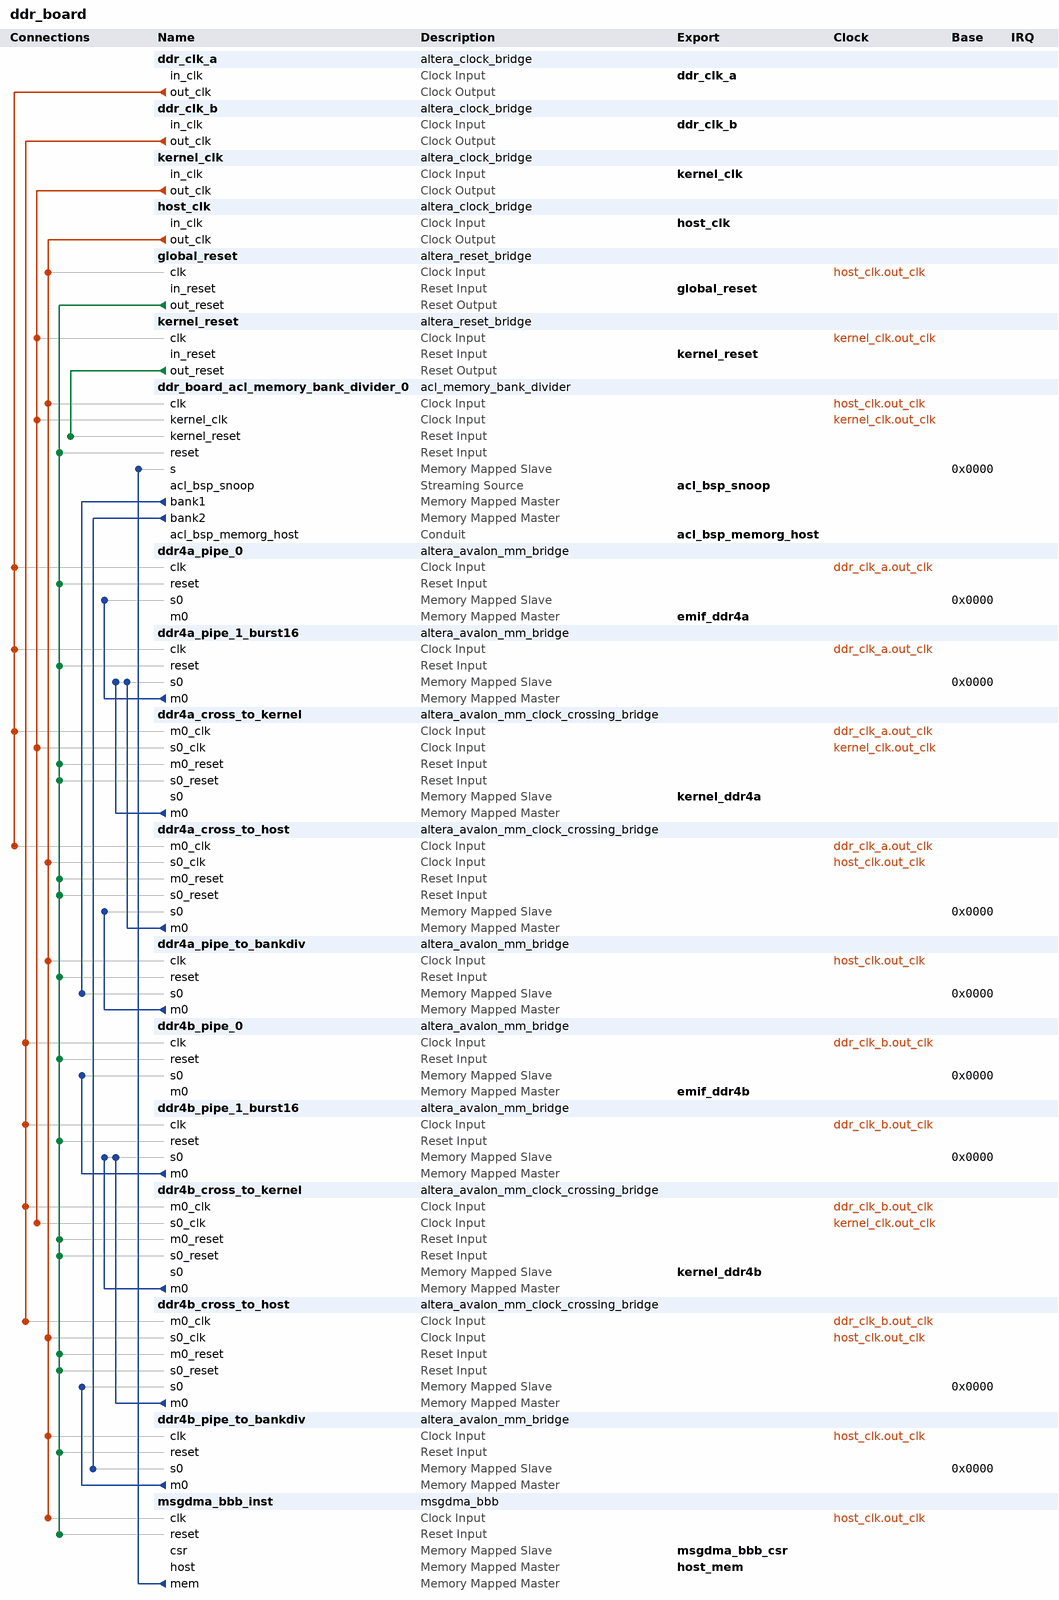
[diagram p0: system contents]
# Platform Designer (Qsys) system ddr_board, Arria 10 10AX115N3F40E2SG
# Parameters at their usual value, and those the tool derives, are not listed.
package require -exact qsys 1.0
create_system ddr_board
set_project_property DEVICE_FAMILY {Arria 10}
set_project_property DEVICE 10AX115N3F40E2SG

add_component ddr_clk_a ip/ddr_board/ddr_board_clock_bridge_0.ip altera_clock_bridge ddr_clk_a 17.0

add_component ddr_clk_b ip/ddr_board/ddr_board_clock_bridge_1.ip altera_clock_bridge ddr_clk_b 17.0
load_component ddr_clk_b
set_component_parameter_value DERIVED_CLOCK_RATE 0
set_component_parameter_value EXPLICIT_CLOCK_RATE 266000000
save_component

add_component kernel_clk ip/ddr_board/kernel_clk.ip altera_clock_bridge kernel_clk 17.0
load_component kernel_clk
set_component_parameter_value DERIVED_CLOCK_RATE 0
set_component_parameter_value EXPLICIT_CLOCK_RATE 0
save_component

add_component host_clk ip/ddr_board/ddr_clk.ip altera_clock_bridge host_clk 17.0
load_component host_clk
set_component_parameter_value DERIVED_CLOCK_RATE 0
set_component_parameter_value EXPLICIT_CLOCK_RATE 200000000
save_component

add_component global_reset ip/ddr_board/ddr_board_reset_bridge_0.ip altera_reset_bridge global_reset 17.0
load_component global_reset
set_component_parameter_value ACTIVE_LOW_RESET 0
set_component_parameter_value SYNCHRONOUS_EDGES deassert
save_component

add_component kernel_reset ip/ddr_board/ddr_board_reset_bridge_1.ip altera_reset_bridge kernel_reset 17.0
load_component kernel_reset
set_component_parameter_value ACTIVE_LOW_RESET 0
set_component_parameter_value SYNCHRONOUS_EDGES deassert
save_component

add_component ddr_board_acl_memory_bank_divider_0 ip/ddr_board/ddr_board_acl_memory_bank_divider_0.ip acl_memory_bank_divider ddr_board_acl_memory_bank_divider_0 1.0
load_component ddr_board_acl_memory_bank_divider_0
set_component_parameter_value NUM_BANKS 2
set_component_parameter_value SEPARATE_RW_PORTS false
set_component_parameter_value PIPELINE_OUTPUTS false
set_component_parameter_value SPLIT_ON_BURSTBOUNDARY true
set_component_parameter_value DATA_WIDTH 512
set_component_parameter_value ADDRESS_WIDTH 33
set_component_parameter_value BURST_SIZE 16
set_component_parameter_value MAX_PENDING_READS 64
save_component

add_component ddr4a_pipe_0 ip/ddr_board/ddr_board_mm_bridge_2.ip altera_avalon_mm_bridge ddr4a_pipe_0 17.0

add_component ddr4a_pipe_1_burst16 ip/ddr_board/ddr_board_mm_bridge_3.ip altera_avalon_mm_bridge ddr4a_pipe_1_burst16 17.0
load_component ddr4a_pipe_1_burst16
set_component_parameter_value DATA_WIDTH 512
set_component_parameter_value ADDRESS_WIDTH 32
set_component_parameter_value USE_AUTO_ADDRESS_WIDTH 0
set_component_parameter_value ADDRESS_UNITS SYMBOLS
set_component_parameter_value MAX_BURST_SIZE 16
set_component_parameter_value MAX_PENDING_RESPONSES 16
save_component

add_component ddr4a_cross_to_kernel ip/ddr_board/ddr_board_mm_clock_crossing_bridge_0.ip altera_avalon_mm_clock_crossing_bridge ddr4a_cross_to_kernel 17.0

add_component ddr4a_cross_to_host ip/ddr_board/ddr_board_mm_clock_crossing_bridge_1.ip altera_avalon_mm_clock_crossing_bridge ddr4a_cross_to_host 17.0
load_component ddr4a_cross_to_host
set_component_parameter_value DATA_WIDTH 512
set_component_parameter_value ADDRESS_WIDTH 32
set_component_parameter_value USE_AUTO_ADDRESS_WIDTH 0
set_component_parameter_value MAX_BURST_SIZE 16
set_component_parameter_value COMMAND_FIFO_DEPTH 64
set_component_parameter_value RESPONSE_FIFO_DEPTH 64
set_component_parameter_value MASTER_SYNC_DEPTH 2
set_component_parameter_value SLAVE_SYNC_DEPTH 2
save_component

add_component ddr4a_pipe_to_bankdiv ip/ddr_board/ddr_board_mm_bridge_1.ip altera_avalon_mm_bridge ddr4a_pipe_to_bankdiv 17.0
load_component ddr4a_pipe_to_bankdiv
set_component_parameter_value DATA_WIDTH 512
set_component_parameter_value ADDRESS_WIDTH 32
set_component_parameter_value USE_AUTO_ADDRESS_WIDTH 0
set_component_parameter_value ADDRESS_UNITS SYMBOLS
set_component_parameter_value MAX_BURST_SIZE 16
set_component_parameter_value MAX_PENDING_RESPONSES 64
save_component

add_component ddr4b_pipe_0 ip/ddr_board/ddr_board_mm_bridge_4.ip altera_avalon_mm_bridge ddr4b_pipe_0 17.0
load_component ddr4b_pipe_0
set_component_parameter_value DATA_WIDTH 512
set_component_parameter_value ADDRESS_WIDTH 32
set_component_parameter_value USE_AUTO_ADDRESS_WIDTH 0
set_component_parameter_value ADDRESS_UNITS SYMBOLS
set_component_parameter_value MAX_BURST_SIZE 64
set_component_parameter_value MAX_PENDING_RESPONSES 16
save_component

add_component ddr4b_pipe_1_burst16 ip/ddr_board/ddr_board_mm_bridge_5.ip altera_avalon_mm_bridge ddr4b_pipe_1_burst16 17.0
load_component ddr4b_pipe_1_burst16
set_component_parameter_value DATA_WIDTH 512
set_component_parameter_value ADDRESS_WIDTH 32
set_component_parameter_value USE_AUTO_ADDRESS_WIDTH 0
set_component_parameter_value ADDRESS_UNITS SYMBOLS
set_component_parameter_value MAX_BURST_SIZE 16
set_component_parameter_value MAX_PENDING_RESPONSES 16
save_component

add_component ddr4b_cross_to_kernel ip/ddr_board/ddr_board_mm_clock_crossing_bridge_2.ip altera_avalon_mm_clock_crossing_bridge ddr4b_cross_to_kernel 17.0
load_component ddr4b_cross_to_kernel
set_component_parameter_value DATA_WIDTH 512
set_component_parameter_value ADDRESS_WIDTH 32
set_component_parameter_value USE_AUTO_ADDRESS_WIDTH 0
set_component_parameter_value MAX_BURST_SIZE 16
set_component_parameter_value COMMAND_FIFO_DEPTH 64
set_component_parameter_value RESPONSE_FIFO_DEPTH 64
set_component_parameter_value MASTER_SYNC_DEPTH 2
set_component_parameter_value SLAVE_SYNC_DEPTH 2
save_component

add_component ddr4b_cross_to_host ip/ddr_board/ddr_board_mm_clock_crossing_bridge_4.ip altera_avalon_mm_clock_crossing_bridge ddr4b_cross_to_host 17.0
load_component ddr4b_cross_to_host
set_component_parameter_value DATA_WIDTH 512
set_component_parameter_value ADDRESS_WIDTH 32
set_component_parameter_value USE_AUTO_ADDRESS_WIDTH 0
set_component_parameter_value MAX_BURST_SIZE 16
set_component_parameter_value COMMAND_FIFO_DEPTH 64
set_component_parameter_value RESPONSE_FIFO_DEPTH 64
set_component_parameter_value MASTER_SYNC_DEPTH 2
set_component_parameter_value SLAVE_SYNC_DEPTH 2
save_component

add_component ddr4b_pipe_to_bankdiv ip/ddr_board/ddr_board_mm_bridge_0.ip altera_avalon_mm_bridge ddr4b_pipe_to_bankdiv 17.0
load_component ddr4b_pipe_to_bankdiv
set_component_parameter_value DATA_WIDTH 512
set_component_parameter_value ADDRESS_WIDTH 32
set_component_parameter_value USE_AUTO_ADDRESS_WIDTH 0
set_component_parameter_value ADDRESS_UNITS SYMBOLS
set_component_parameter_value MAX_BURST_SIZE 16
set_component_parameter_value MAX_PENDING_RESPONSES 64
save_component

add_instance msgdma_bbb_inst msgdma_bbb 1.0

# connections
add_connection ddr_clk_a.out_clk ddr4a_cross_to_host.m0_clk clock
add_connection ddr_clk_a.out_clk ddr4a_cross_to_kernel.m0_clk clock
add_connection ddr_clk_a.out_clk ddr4a_pipe_0.clk clock
add_connection ddr_clk_a.out_clk ddr4a_pipe_1_burst16.clk clock
add_connection ddr_clk_b.out_clk ddr4b_cross_to_host.m0_clk clock
add_connection ddr_clk_b.out_clk ddr4b_cross_to_kernel.m0_clk clock
add_connection ddr_clk_b.out_clk ddr4b_pipe_0.clk clock
add_connection ddr_clk_b.out_clk ddr4b_pipe_1_burst16.clk clock
add_connection host_clk.out_clk ddr4a_cross_to_host.s0_clk clock
add_connection host_clk.out_clk ddr4a_pipe_to_bankdiv.clk clock
add_connection host_clk.out_clk ddr4b_cross_to_host.s0_clk clock
add_connection host_clk.out_clk ddr4b_pipe_to_bankdiv.clk clock
add_connection host_clk.out_clk ddr_board_acl_memory_bank_divider_0.clk clock
add_connection host_clk.out_clk global_reset.clk clock
add_connection host_clk.out_clk msgdma_bbb_inst.clk clock
add_connection kernel_clk.out_clk ddr4a_cross_to_kernel.s0_clk clock
add_connection kernel_clk.out_clk ddr4b_cross_to_kernel.s0_clk clock
add_connection kernel_clk.out_clk ddr_board_acl_memory_bank_divider_0.kernel_clk clock
add_connection kernel_clk.out_clk kernel_reset.clk clock
add_connection global_reset.out_reset ddr4a_cross_to_host.m0_reset reset
add_connection global_reset.out_reset ddr4a_cross_to_host.s0_reset reset
add_connection global_reset.out_reset ddr4a_cross_to_kernel.m0_reset reset
add_connection global_reset.out_reset ddr4a_cross_to_kernel.s0_reset reset
add_connection global_reset.out_reset ddr4a_pipe_0.reset reset
add_connection global_reset.out_reset ddr4a_pipe_1_burst16.reset reset
add_connection global_reset.out_reset ddr4a_pipe_to_bankdiv.reset reset
add_connection global_reset.out_reset ddr4b_cross_to_host.m0_reset reset
add_connection global_reset.out_reset ddr4b_cross_to_host.s0_reset reset
add_connection global_reset.out_reset ddr4b_cross_to_kernel.m0_reset reset
add_connection global_reset.out_reset ddr4b_cross_to_kernel.s0_reset reset
add_connection global_reset.out_reset ddr4b_pipe_0.reset reset
add_connection global_reset.out_reset ddr4b_pipe_1_burst16.reset reset
add_connection global_reset.out_reset ddr4b_pipe_to_bankdiv.reset reset
add_connection global_reset.out_reset ddr_board_acl_memory_bank_divider_0.reset reset
add_connection global_reset.out_reset msgdma_bbb_inst.reset reset
add_connection kernel_reset.out_reset ddr_board_acl_memory_bank_divider_0.kernel_reset reset
add_connection ddr4a_cross_to_host.m0 ddr4a_pipe_1_burst16.s0 avalon
set_connection_parameter_value ddr4a_cross_to_host.m0/ddr4a_pipe_1_burst16.s0 baseAddress 0x0000
add_connection ddr4a_cross_to_kernel.m0 ddr4a_pipe_1_burst16.s0 avalon
set_connection_parameter_value ddr4a_cross_to_kernel.m0/ddr4a_pipe_1_burst16.s0 baseAddress 0x0000
add_connection ddr4a_pipe_1_burst16.m0 ddr4a_pipe_0.s0 avalon
set_connection_parameter_value ddr4a_pipe_1_burst16.m0/ddr4a_pipe_0.s0 baseAddress 0x0000
add_connection ddr4a_pipe_to_bankdiv.m0 ddr4a_cross_to_host.s0 avalon
set_connection_parameter_value ddr4a_pipe_to_bankdiv.m0/ddr4a_cross_to_host.s0 baseAddress 0x0000
add_connection ddr4b_cross_to_host.m0 ddr4b_pipe_1_burst16.s0 avalon
set_connection_parameter_value ddr4b_cross_to_host.m0/ddr4b_pipe_1_burst16.s0 baseAddress 0x0000
add_connection ddr4b_cross_to_kernel.m0 ddr4b_pipe_1_burst16.s0 avalon
set_connection_parameter_value ddr4b_cross_to_kernel.m0/ddr4b_pipe_1_burst16.s0 baseAddress 0x0000
add_connection ddr4b_pipe_1_burst16.m0 ddr4b_pipe_0.s0 avalon
set_connection_parameter_value ddr4b_pipe_1_burst16.m0/ddr4b_pipe_0.s0 baseAddress 0x0000
add_connection ddr4b_pipe_to_bankdiv.m0 ddr4b_cross_to_host.s0 avalon
set_connection_parameter_value ddr4b_pipe_to_bankdiv.m0/ddr4b_cross_to_host.s0 baseAddress 0x0000
add_connection ddr_board_acl_memory_bank_divider_0.bank1 ddr4a_pipe_to_bankdiv.s0 avalon
set_connection_parameter_value ddr_board_acl_memory_bank_divider_0.bank1/ddr4a_pipe_to_bankdiv.s0 baseAddress 0x0000
add_connection ddr_board_acl_memory_bank_divider_0.bank2 ddr4b_pipe_to_bankdiv.s0 avalon
set_connection_parameter_value ddr_board_acl_memory_bank_divider_0.bank2/ddr4b_pipe_to_bankdiv.s0 baseAddress 0x0000
add_connection msgdma_bbb_inst.mem ddr_board_acl_memory_bank_divider_0.s avalon
set_connection_parameter_value msgdma_bbb_inst.mem/ddr_board_acl_memory_bank_divider_0.s baseAddress 0x0000

# exported interfaces
add_interface acl_bsp_memorg_host conduit end
set_interface_property acl_bsp_memorg_host EXPORT_OF ddr_board_acl_memory_bank_divider_0.acl_bsp_memorg_host
add_interface acl_bsp_snoop avalon_streaming source
set_interface_property acl_bsp_snoop EXPORT_OF ddr_board_acl_memory_bank_divider_0.acl_bsp_snoop
add_interface ddr_clk_a clock sink
set_interface_property ddr_clk_a EXPORT_OF ddr_clk_a.in_clk
add_interface ddr_clk_b clock sink
set_interface_property ddr_clk_b EXPORT_OF ddr_clk_b.in_clk
add_interface emif_ddr4a avalon master
set_interface_property emif_ddr4a EXPORT_OF ddr4a_pipe_0.m0
add_interface emif_ddr4b avalon master
set_interface_property emif_ddr4b EXPORT_OF ddr4b_pipe_0.m0
add_interface global_reset reset sink
set_interface_property global_reset EXPORT_OF global_reset.in_reset
add_interface host_clk clock sink
set_interface_property host_clk EXPORT_OF host_clk.in_clk
add_interface host_mem avalon master
set_interface_property host_mem EXPORT_OF msgdma_bbb_inst.host
add_interface kernel_clk clock sink
set_interface_property kernel_clk EXPORT_OF kernel_clk.in_clk
add_interface kernel_ddr4a avalon slave
set_interface_property kernel_ddr4a EXPORT_OF ddr4a_cross_to_kernel.s0
add_interface kernel_ddr4b avalon slave
set_interface_property kernel_ddr4b EXPORT_OF ddr4b_cross_to_kernel.s0
add_interface kernel_reset reset sink
set_interface_property kernel_reset EXPORT_OF kernel_reset.in_reset
add_interface msgdma_bbb_csr avalon slave
set_interface_property msgdma_bbb_csr EXPORT_OF msgdma_bbb_inst.csr

set_interconnect_requirement {$system} qsys_mm.clockCrossingAdapter HANDSHAKE
set_interconnect_requirement {$system} qsys_mm.enableEccProtection FALSE
set_interconnect_requirement {$system} qsys_mm.insertDefaultSlave FALSE
set_interconnect_requirement {$system} qsys_mm.maxAdditionalLatency 1

save_system ddr_board.qsys
